# EAGLE design auto (EAGLE 7.5.0)
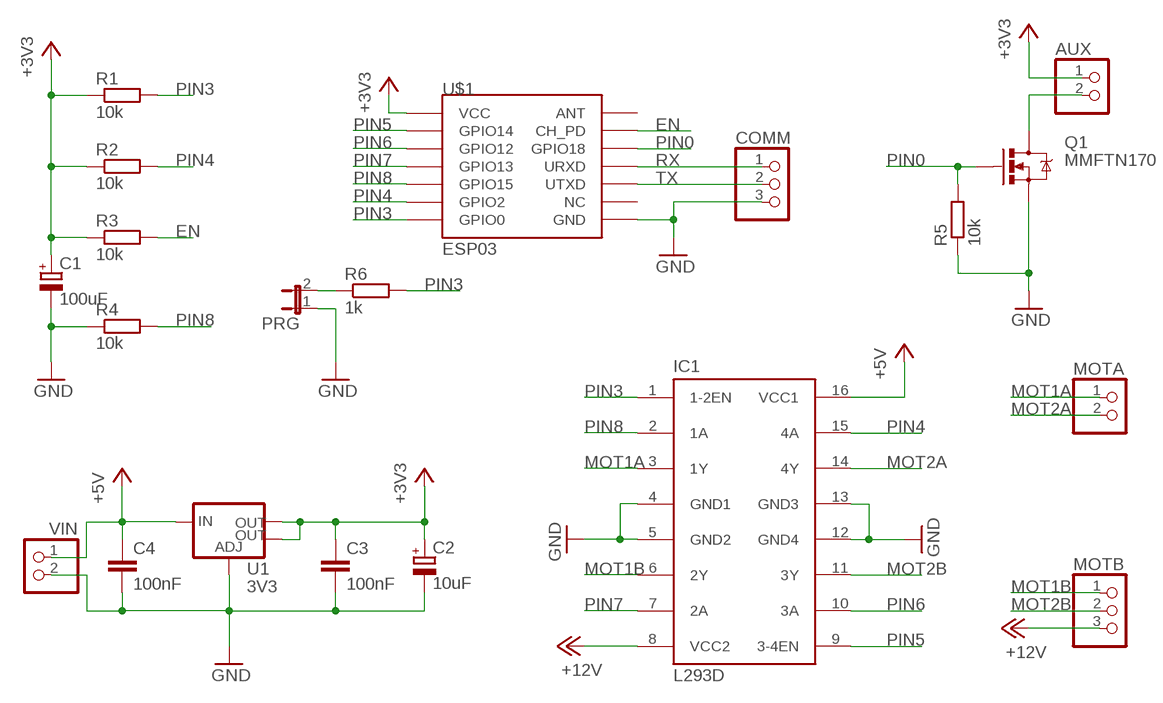
[diagram p0: schematic, sheet 1]

## Parts
AUX  PINHD-1X2  [1X02]
C1  100uF  CPOL-EUE2.5-5  [E2,5-5]
C2  10uF  CPOL-EUE2.5-5  [E2,5-5]
C3  100nF  C-EUC1206  [C1206]
C4  100nF  C-EUC1206  [C1206]
COMM  PINHD-1X3  [1X03]
IC1  L293D  [DIL16]
MOTA  PINHD-1X2  [1X02]
MOTB  PINHD-1X3  [1X03]
PRG  JP1E  [JP1]
Q1  MMFTN170  MOSFET-NCHANNELAO3404A  [SOT23-3]
R1  10k  R-EU_R0805  [R0805]
R2  10k  R-EU_R0805  [R0805]
R3  10k  R-EU_R0805  [R0805]
R4  10k  R-EU_R0805  [R0805]
R5  10k  R-EU_R0805  [R0805]
R6  1k  R-EU_R0805  [R0805]
U1  3V3  V_REG_LM1117SOT223  [SOT223]
U$1  ESP03  [ESP03]
VIN  PINHD-1X2  [1X02]

## Nets
+3V3: AUX.1 C1.+ C2.+ C3.1 R1.1 R2.1 R3.1 U1.2(OUT) U1.4(OUT) U$1.VCC
+5V: C4.1 IC1.16(VCC1) U1.3(IN) VIN.1
+12V: IC1.8(VCC2) MOTB.3
EN: R3.2 U$1.CH_PD
GND: C1.- C2.- C3.2 C4.2 COMM.3 IC1.4(GND1) IC1.5(GND2) IC1.12(GND4) IC1.13(GND3) PRG.1 Q1.2(S) R4.1 R5.1 U1.1(ADJ) U$1.GND VIN.2
MOT1A: IC1.3(1Y) MOTA.1
MOT1B: IC1.6(2Y) MOTB.1
MOT2A: IC1.14(4Y) MOTA.2
MOT2B: IC1.11(3Y) MOTB.2
N$1: AUX.2 Q1.3(D)
N$2: PRG.2 R6.1
PIN0: Q1.1(G) R5.2 U$1.GPIO18
PIN3: IC1.1(1-2EN) R1.2 R6.2 U$1.GPIO0
PIN4: IC1.15(4A) R2.2 U$1.GPIO2
PIN5: IC1.9(3-4EN) U$1.GPIO14
PIN6: IC1.10(3A) U$1.GPIO12
PIN7: IC1.7(2A) U$1.GPIO13
PIN8: IC1.2(1A) R4.2 U$1.GPIO15
RX: COMM.1 U$1.URXD
TX: COMM.2 U$1.UTXD
Unconnected: U$1.ANT U$1.NC

## Library data of the parts
AUX MOTA VIN = pinhead:PINHD-1X2: PIN HEADER
C1 C2 = rcl:CPOL-EU: POLARIZED CAPACITOR, European symbol
C3 C4 = rcl:C-EU: CAPACITOR, European symbol
COMM MOTB = pinhead:PINHD-1X3: PIN HEADER
IC1 = st-microelectronics:L293D: PUSH-PULL 4 CHANNEL DRIVER; MPN: L293D; OC_FARNELL: 9589619; OC_NEWARK: 56P8249
PRG = jumper:JP1E: JUMPER
Q1 = SparkFun-DiscreteSemi:MOSFET-NCHANNEL: Common NMOSFET Parts MFG P/N Store ID Prod ID FDD8780 TRANS-09984 SI7820DN TRANS-11055 FDS6630A IC-08089 2N7002PW TRANS-11151 FQP30N06L COM-10213 TRANS-10060 BSS123LT1G TRANS-08345 BSS138 TRANS-00830 BS170 2N7000; PROD_ID: TRAN-12988
R1-R6 = rcl:R-EU_: RESISTOR, European symbol
U1 = SparkFun-PowerIC:V_REG_LM1117: Voltage Regulator LM1117 Standard adjustable voltage regulator but in SMD form. Spark Fun Electronics SKU : COM-00595; PROD_ID: VREG-08170
U$1 = esp8266modules:ESP03: ESP8266 Wifi module 03; DIMENSIONS: 17.3 x 12.1 mm; PINS: 14; PITCH: 0.078" / 2 mm

## Board
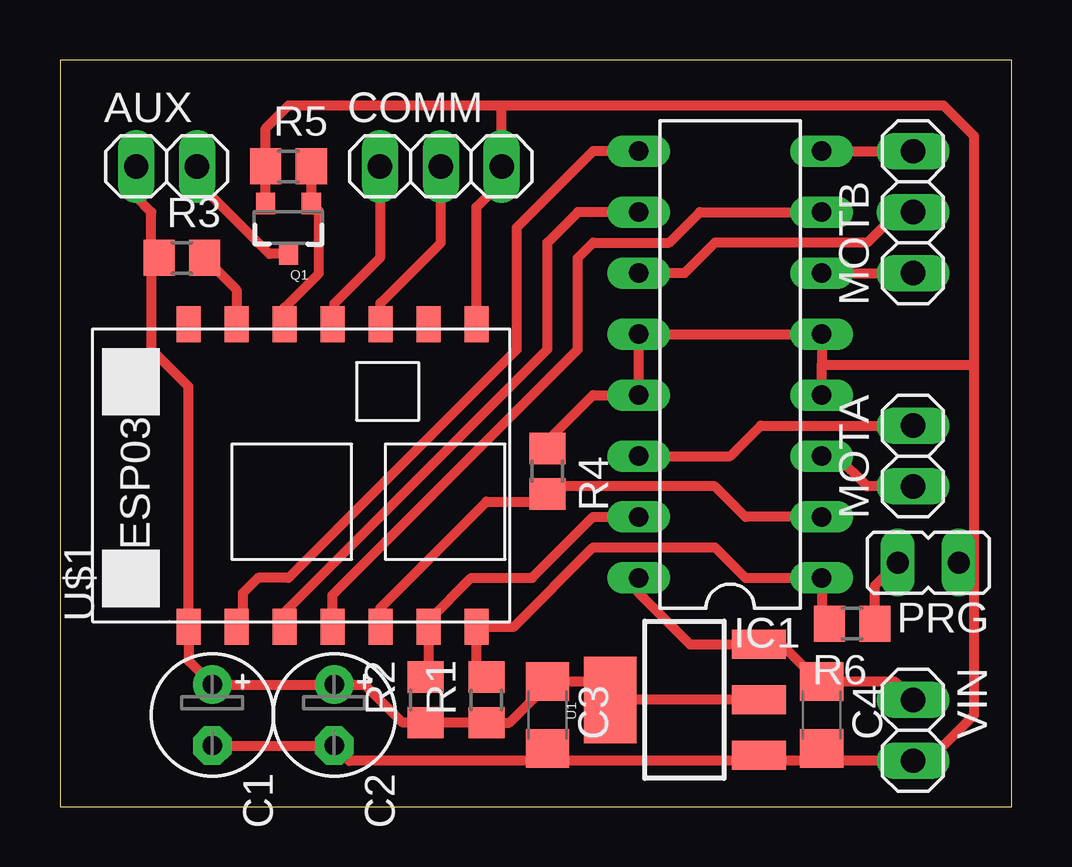
[diagram p1: board, top side]

Size 39.68 x 31.1 mm. Coordinates in mm from the lower left corner, seen from the top.
Outline: 0,0 39.68,0 39.68,31.1 0,31.1 0,0
Copper layers (1*16): Top 0.035mm / dielectric 1.5mm / Bottom 0.035mm
Design rules "default *": minimum track width 16mil, minimum drill 24mil, track to track 16mil, track to pad 16mil, pad to pad 16mil, via to via 16mil, smd to smd 8mil, copper to edge 40mil, drill to drill 8mil, minimum pad ring 10mil, minimum via ring 8mil, stop-mask expansion 4mil, vias tented up to drill 0mil, thermal gap 10mil

### Footprints (pad centres in the part's own frame; a part is rotated, then mirrored left to right if it is on the bottom)
1X02 = drill 1.016 long: 1 -1.27,0; 2 1.27,0
E2,5-5 = drill 0.813 pad 1.6: + -1.27,0 | drill 0.813 pad 1.6 octagon: - 1.27,0
C1206 = smd 1.6 x 1.8: 1 -1.4,0; 2 1.4,0
1X03 = drill 1.016 long: 1 -2.54,0; 2 0,0; 3 2.54,0
DIL16 = drill 0.813 long: 1 -8.89,-3.81; 2 -6.35,-3.81; 3 -3.81,-3.81; 4 -1.27,-3.81; 5 1.27,-3.81; 6 3.81,-3.81; 7 6.35,-3.81; 8 8.89,-3.81; 9 8.89,3.81; 10 6.35,3.81; 11 3.81,3.81; 12 1.27,3.81; 13 -1.27,3.81; 14 -3.81,3.81; 15 -6.35,3.81; 16 -8.89,3.81
JP1 = drill 0.914 long: 1 0,-1.27; 2 0,1.27
SOT23-3 = smd 0.8 x 0.9: 1 -0.95,-1; 2 0.95,-1; 3 0,1.1
R0805 = smd 1.3 x 1.5: 1 -0.95,0; 2 0.95,0
SOT223 = smd 1.219 x 2.235: 1 -2.311,-3.099; 2 0,-3.099; 3 2.311,-3.099 | smd 3.6 x 2.2: 4 0,3.099
ESP03 = smd 1.5 x 1: ANT 7.4,4.8; CH_PD 7.4,2.8; GND 7.4,-7.2; GPIO0 -5.2,-7.2; GPIO2 -5.2,-5.2; GPIO12 -5.2,0.8; GPIO13 -5.2,-1.2; GPIO14 -5.2,2.8; GPIO15 -5.2,-3.2; GPIO18 7.4,0.8; NC 7.4,-5.2; URXD 7.4,-1.2; UTXD 7.4,-3.2; VCC -5.2,4.8

### Placement (x,y rotation side)
AUX  4.44,26.67 0 top
C1  6.35,3.81 270 top
C2  11.43,3.81 270 top
C3  20.32,3.81 270 top
C4  31.75,3.81 270 top
COMM  15.88,26.67 0 top
IC1  27.94,18.41 90 top
MOTA  35.56,14.6 90 top
MOTB  35.56,24.77 90 top
PRG  36.2,10.16 90 top
Q1  9.52,24.13 180 top
R1  17.78,4.44 90 top
R2  15.24,4.44 90 top
R3  5.08,22.86 0 top
R4  20.32,13.97 270 top
R5  9.52,26.67 0 top
R6  33.02,7.62 180 top
U1  26.04,4.44 90 top
U$1  10.16,12.7 90 top
VIN  35.56,3.17 270 top

### Tracks (layer width: path | path; a pad name or v marks a point on that pad's centre or on a via)
+3V3
  Top 0.406: R3.1 3.81,22.86 | 3.81,22.86 3.81,19.05 5.36,17.5 U$1.VCC 5.36,6.07 C1.+ C2.+ 12.7,5.08 14.29,3.49 R2.1 R1.1 | R1.1 17.78,3.25 | U1.2 U1.4 22.17,5.21 C3.1 20.32,5.08 18.73,3.49 R1.1 | 3.81,22.86 3.81,24.77 3.17,25.4 AUX.1
+5V
  Top 0.406: IC1.16 24.13,8.89 26.26,6.76 U1.3 | U1.3 29.57,6.76 | VIN.1 34.8,5.21 C4.1 31.62,5.21 29.85,6.98 29.36,6.98 U1.3
+12V
  Top 0.406: IC1.8 MOTB.3
EN
  Top 0.406: 7.3,20.1 U$1.CH_PD 7.36,21.53 R3.2
GND
  Top 0.406: C1.- C2.- 12.06,1.9 19.81,1.9 C3.2 | 31.75,1.9 VIN.2 36.2,1.9 38.1,3.81 38.1,10.16 | 31.75,1.9 29.21,1.9 | 29.21,1.9 20.82,1.9 C3.2 | C3.2 20.32,2.54 | C4.2 31.75,1.9 | U1.1 29.13,1.98 29.21,1.9 | 31.75,18.41 IC1.5 IC1.12 IC1.13 22.22,17.14 20.32,15.24 R4.1 | 31.75,18.41 38.1,18.41 | 38.1,18.41 38.1,10.16 | IC1.4 31.75,18.41 | U$1.GND 17.36,24.98 18.41,26.03 COMM.3 18.41,29.21 | 18.41,29.21 9.52,29.21 8.57,28.26 R5.1 Q1.2 | 18.41,29.21 36.83,29.21 38.1,27.94 38.1,18.41 | PRG.1 38.1,10.16
MOT1A
  Top 0.406: MOTA.1 33.66,13.34 32.39,14.6 IC1.3
MOT1B
  Top 0.406: IC1.6 MOTB.1
MOT2A
  Top 0.406: IC1.14 27.94,14.6 29.21,15.88 MOTA.2
MOT2B
  Top 0.406: IC1.11 26.04,22.23 27.3,23.49 33.66,23.49 34.93,24.77 MOTB.2
N$1
  Top 0.406: Q1.3 8.72,23.03 5.72,26.03 AUX.2
N$2
  Top 0.406: R6.1 33.97,9.2 PRG.2
PIN0
  Top 0.406: R5.2 Q1.1 10.79,24.81 10.79,22.23 9.36,20.79 U$1.GPIO18
PIN3
  Top 0.406: R1.2 17.36,5.81 U$1.GPIO0 18.93,7.5 22.22,10.8 27.3,10.8 28.57,9.52 IC1.1 31.75,7.3 R6.2
PIN4
  Top 0.406: 15.24,7.62 U$1.GPIO2 | U$1.GPIO2 15.36,5.52 R2.2 | U$1.GPIO2 15.36,7.74 17.14,9.52 19.68,9.52 22.22,12.06 IC1.15
PIN5
  Top 0.406: IC1.9 22.22,27.3 19.05,24.13 19.05,19.05 9.52,9.52 8.25,9.52 7.62,8.89 7.62,7.76 U$1.GPIO14
PIN6
  Top 0.406: U$1.GPIO12 9.36,8.09 20.32,19.05 20.32,23.49 21.59,24.77 IC1.10
PIN7
  Top 0.406: U$1.GPIO13 11.36,8.82 21.59,19.05 21.59,22.86 22.22,23.49 25.4,23.49 26.67,24.77 IC1.7
PIN8
  Top 0.406: U$1.GPIO15 13.36,8.28 17.78,12.7 20,12.7 R4.2 20.63,13.34 27.3,13.34 28.57,12.06 IC1.2
RX
  Top 0.406: COMM.1 13.33,22.86 11.43,20.95 11.43,20.17 U$1.URXD
TX
  Top 0.406: U$1.UTXD 13.36,20.98 15.88,23.49 COMM.2